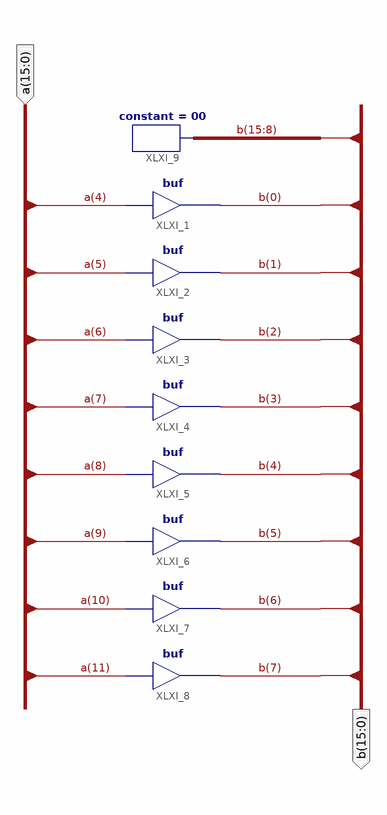
[diagram p0: schematic sheet 1]
// Xilinx ISE schematic immediat.sch (spartan3e) as structural Verilog: 9 symbols, 2 ports
module immediat (
  input  [15:0] a,
  output [15:0] b
);

  buf XLXI_1 (b[0], a[4]);
  buf XLXI_2 (b[1], a[5]);
  buf XLXI_3 (b[2], a[6]);
  buf XLXI_4 (b[3], a[7]);
  buf XLXI_5 (b[4], a[8]);
  buf XLXI_6 (b[5], a[9]);
  buf XLXI_7 (b[6], a[10]);
  buf XLXI_8 (b[7], a[11]);
  constant #(.CValue("00")) XLXI_9 (.O(b[15:8]));
endmodule
